# Altium schematic sheet Blackbox_aaa_Empty_PCB_2_Layers.SchDoc
size A3; DocumentNumber: 1; SheetNumber: 1; SheetTotal: 2
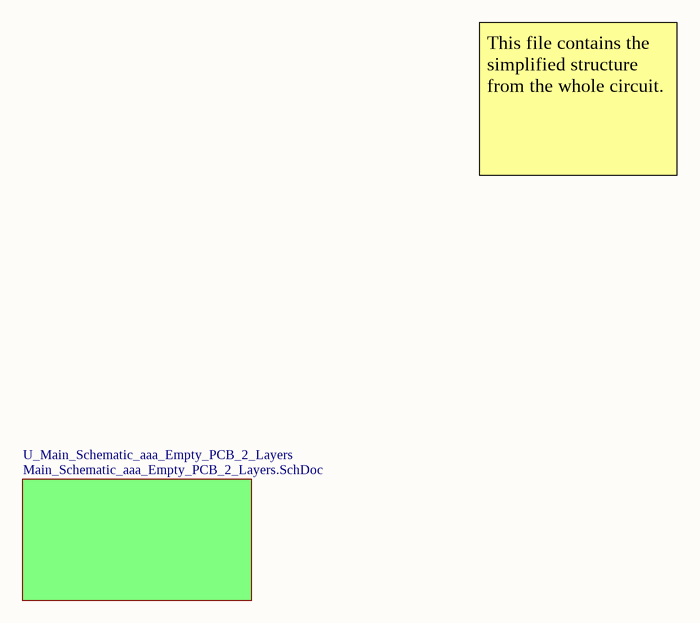
[diagram p0: Blackbox_aaa_Empty_PCB_2_Layers.SchDoc]

## Sub-sheets
U_Main_Schematic_aaa_Empty_PCB_2_Layers = Main_Schematic_aaa_Empty_PCB_2_Layers.SchDoc: no entries

## Notes on the sheet
- This file contains the simplified structure from the whole circuit.
- Date:
- Title of drawing:
- Time:
- Drawn by:
- Project:
- Revision:
- Page:
- from:
- File: